# Altium schematic sheet XL_N76E003K1._MAIN.SchDoc
size A4
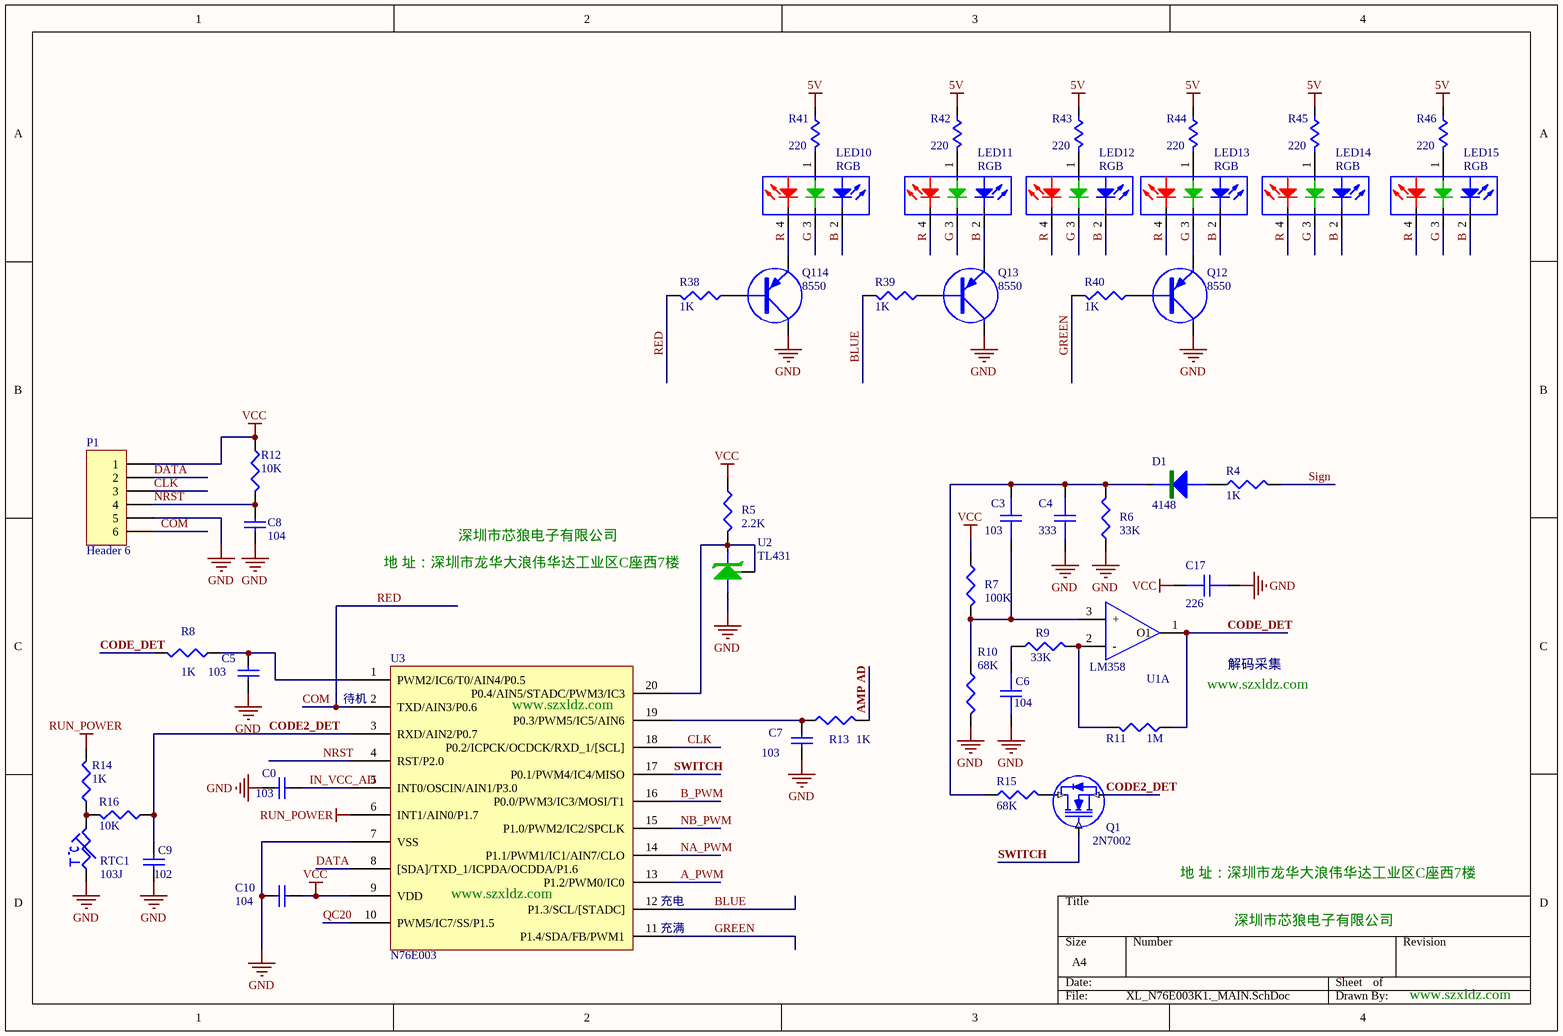
[diagram p0: XL_N76E003K1._MAIN.SchDoc]

## Parts
C0  103  [C0402]
C3  103  [C0402]
C4  333  [C0402]
C5  103  [C0402]
C6  104  [C0402]
C7  103  [C0402]
C8  104  [C0402]
C9  102  [C0402]
C10  104  [C0402]
C17  226  [C0805]
D1  4148  [sod323]
LED10  RGB  [LED-RGB01]
LED11  RGB  [LED-RGB01]
LED12  RGB  [LED-RGB01]
LED13  RGB  [LED-RGB01]
LED14  RGB  [LED-RGB01]
LED15  RGB  [LED-RGB01]
P1  Header 6  [SPIN6]
Q1  2N7002  [SOT-23B]
Q12  8550  [SOT-23]
Q13  8550  [SOT-23]
Q114  8550  [SOT-23]
R4  1K  [R0402]
R5  2.2K  [R0402]
R6  33K  [R0402]
R7  100K  [R0402]
R8  1K  [R0402]
R9  33K  [R0402]
R10  68K  [R0402]
R11  1M  [R0402]
R12  10K  [R0402]
R13  1K  [R0402]
R14  1K  [R0402]
R15  68K  [R0402]
R16  10K  [R0402]
R38  1K  [R0402]
R39  1K  [R0402]
R40  1K  [R0402]
R41  220  [R0603]
R42  220  [R0603]
R43  220  [R0603]
R44  220  [R0603]
R45  220  [R0603]
R46  220  [R0603]
RTC1  103J  [R0402]
U1  LM358  [SOP8]  (part A of 2)
U2  TL431  [SOT-23-431]
U3  N76E003  [SOP20]

## Nets
5V: R41.1 R42.1 R43.1 R44.1 R45.1 R46.1
GND: C0.1 C4.1 C5.1 C6.1 C7.2 C8.2 C9.1 C10.1 C17.1 P1.5 Q12.C Q13.C Q114.C R6.1 R10.2 RTC1.1 U2.1 U3.7(VSS)
RUN_POWER: R14.2 U3.6(INT1/AIN0/P1.7)
VCC: C10.2 C17.2 P1.1 R5.1 R7.1 R12.1 U3.9(VDD)
A_PWM: U3.13(P1.2/PWM0/IC0)
AMP AD: R13.2
B: LED10.2(A) LED11.2(A) LED12.2(A) LED13.2(A) LED14.2(A) LED15.2(A) Q13.E
B_PWM: U3.16(P0.0/PWM3/IC3/MOSI/T1)
BLUE: R39.2 U3.12(P1.3/SCL/[STADC])
CLK: P1.3 U3.18(P0.2/ICPCK/OCDCK/RXD_1/[SCL])
CODE2_DET: C9.2 Q1.E(S) R16.1 U3.3(RXD/AIN2/P0.7)
CODE_DET: R8.2 R11.1 U1.1(O1)
COM: P1.6 R38.2 U3.2(TXD/AIN3/P0.6)  [also labelled RED]
DATA: P1.2 U3.8([SDA]/TXD_1/ICPDA/OCDDA/P1.6)
G: LED10.3 LED11.3 LED12.3 LED13.3 LED14.3 LED15.3 Q12.E
GREEN: R40.2 U3.11(P1.4/SDA/FB/PWM1)
IN_VCC_AD: C0.2 U3.5(INT0/OSCIN/AIN1/P3.0)
NA_PWM: U3.14(P1.1/PWM1/IC1/AIN7/CLO)
NB_PWM: U3.15(P1.0/PWM2/IC2/SPCLK)
NRST: C8.1 P1.4 R12.2 U3.4(RST/P2.0)
QC20: U3.10(PWM5/IC7/SS/P1.5)
R: LED10.4 LED11.4 LED12.4 LED13.4 LED14.4 LED15.4 Q114.E
Sign: R4.2
SWITCH: Q1.B(G) U3.17(P0.1/PWM4/IC4/MISO)
NetC3_1: C3.1 C4.2 D1.2 R6.2 R15.1
NetC3_2: C3.2 R7.2 R10.1 U1.3(+)
NetC5_2: C5.2 R8.1 U3.1(PWM2/IC6/T0/AIN4/P0.5)
NetC6_2: C6.2 R9.1
NetC7_1: C7.1 R13.1 U3.19(P0.3/PWM5/IC5/AIN6)
NetD1_1: D1.1 R4.1
NetLED10_1: LED10.1(A) R41.2
NetLED11_1: LED11.1(A) R42.2
NetLED12_1: LED12.1(A) R43.2
NetLED13_1: LED13.1(A) R44.2
NetLED14_1: LED14.1(A) R45.2
NetLED15_1: LED15.1(A) R46.2
NetQ1_C: Q1.C(D) R15.2
NetQ12_B: Q12.B R40.1
NetQ13_B: Q13.B R39.1
NetQ114_B: Q114.B R38.1
NetR5_2: R5.2 U2.2 U2.3 U3.20(P0.4/AIN5/STADC/PWM3/IC3)
NetR9_2: R9.2 R11.2 U1.2(-)
NetR14_1: R14.1 R16.2 RTC1.2

## Notes on the sheet
- 地 址：深圳市龙华大浪伟华达工业区C座西7楼
- 深圳市芯狼电子有限公司
- (near U3) 待机
- (near U3) www.szxldz.com
- www.szxldz.com
- 解码采集
- (near U3) 充电
- (near U3) 充满

## Library data of the parts
C0 C5 C7-C10 = Cap: Capacitor; Published: 8-Jun-2000; LatestRevisionDate: 17-Jul-2002; LatestRevisionNote: Re-released for DXP Platform.; Publisher: Altium Limited
  C5 C7: Value: 103
  C8: Value: 104
  C9: Value: 102
C3 C4 C6 C17 = CH
D1 = D0: 1N4001
LED10-LED15 = LED05
P1 = Header 6: Header, 6-Pin; LatestRevisionDate: 17-Jul-2002; LatestRevisionNote: Re-released for DXP Platform.; Publisher: Altium Limited
Q1 = MOSFETN
Q12 Q13 Q114 = PNP
R4 R8 R12-R14 R38-R40 = R
R5-R7 R9-R11 R15 R16 = R: 1K
R41-R46 = Res01
RTC1 = RTC
U1 = 4558
U2 = IC TL431: IC
U3 = 103F